# Altium schematic sheet Preregulation.SchDoc
size A3
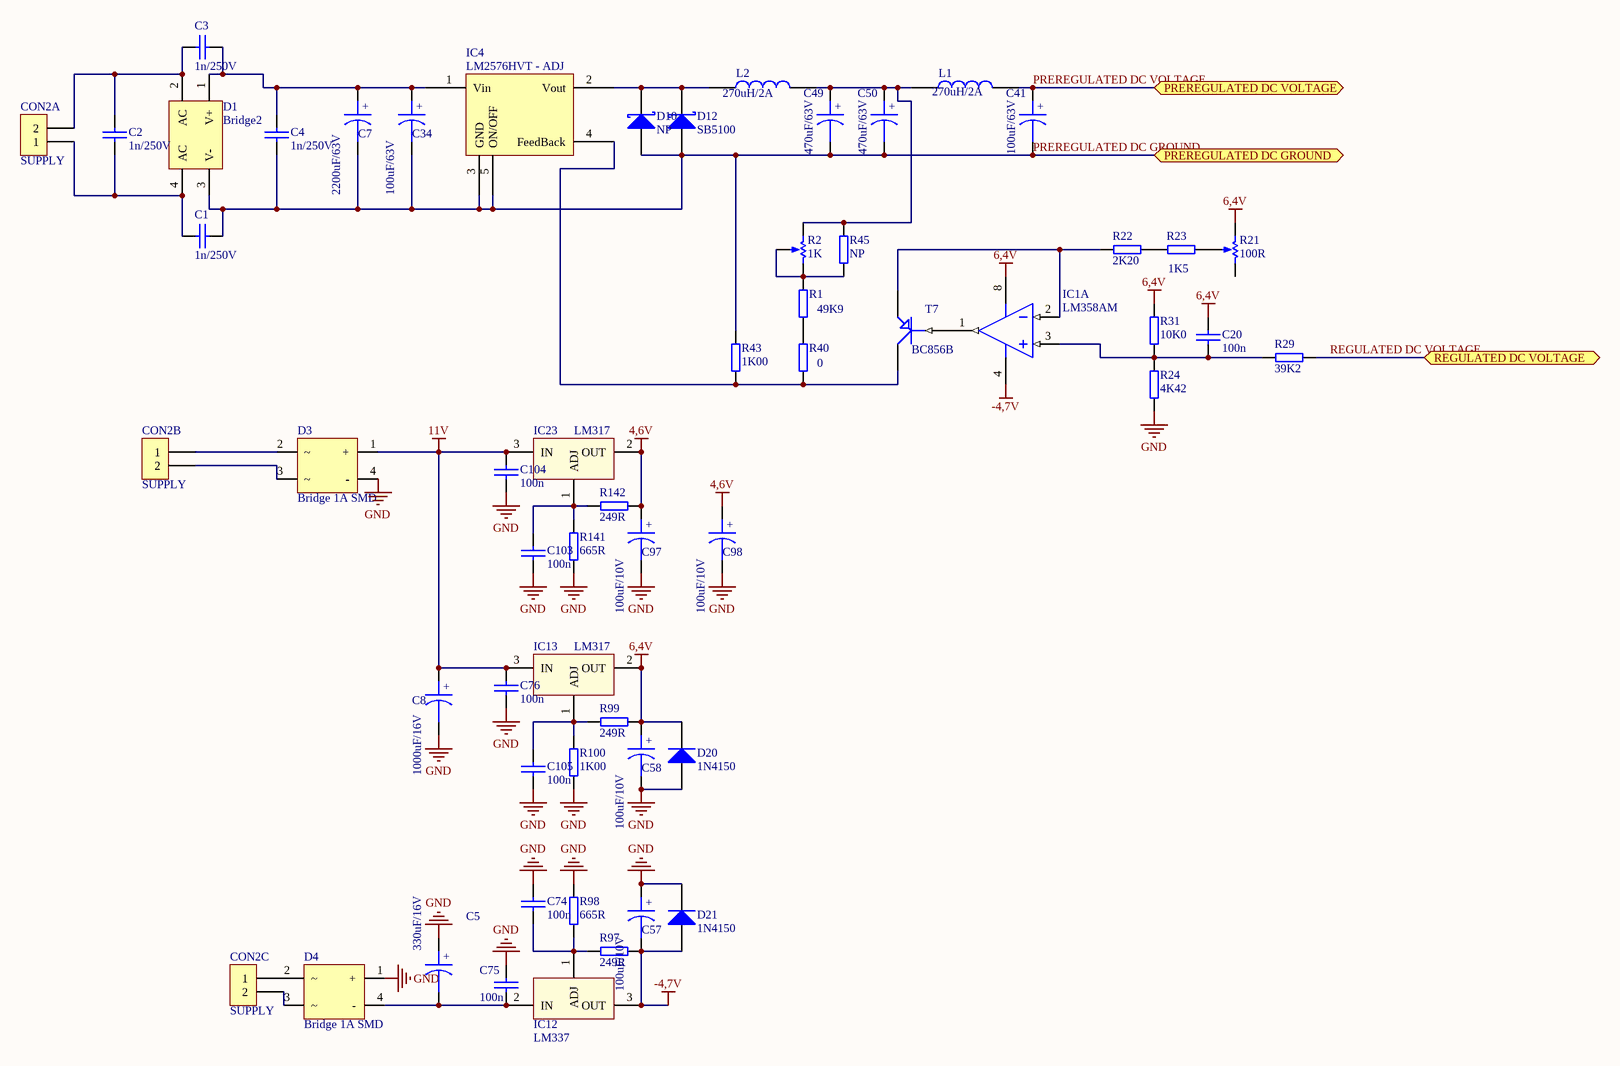
[diagram p0: Preregulation.SchDoc]

## Parts
C1  1n/250V  [CAPC3225X220N]
C2  1n/250V  [CAPC3225X220N]
C3  1n/250V  [CAPC3225X220N]
C4  1n/250V  [CAPC3225X220N]
C5  330uF/16V  [CAP40x20]
C7  2200uF/63V  [CP4/8.5]
C8  1000uF/16V  [CAP40x20]
C20  100n  [SM-0805]
C34  100uF/63V  [CP2/5]
C41  100uF/63V  [CP2/5]
C49  470uF/63V  [CP3/7]
C50  470uF/63V  [CP3/7]
C57  100uF/10V  [CP1/2.5]
C58  100uF/10V  [CP1/2.5]
C74  100n  [SM-0805]
C75  100n  [SM-0805]
C76  100n  [SM-0805]
C97  100uF/10V  [CP1/2.5]
C98  100uF/10V  [CP1/2.5]
C103  100n  [SM-0805]
C104  100n  [SM-0805]
C105  100n  [SM-0805]
CON2A  SUPPLY  [JACK2_NAM]
CON2B  SUPPLY  [JACK2_NAM]
CON2C  SUPPLY  [JACK2_NAM]
D1  Bridge2  [DIODE BRIDGE(FLAT) BIG]
D3  Bridge 1A SMD  [SDIP]
D4  Bridge 1A SMD  [SDIP]
D10  NP  [TO-220AC]
D12  SB5100  [D5A]
D20  1N4150  [SOD80, LL-34]
D21  1N4150  [SOD80, LL-34]
IC1  LM358AM  [SO-8]  (part A of 2)
IC4  LM2576HVT - ADJ  [LM2576]
IC12  LM337  [QTO-220]
IC13  LM317  [MP04A_N]
IC23  LM317  [QTO-220N]
L1  270uH/2A  [CP2/5]
L2  270uH/2A  [Trans6c]
R1  49K9  [SM-0805]
R2  1K  [POT SMD 3mm]
R21  100R  [POT SMD 3mm]
R22  2K20  [SM-0805]
R23  1K5  [SM-0805]
R24  4K42  [SM-0805]
R29  39K2  [SM-0805]
R31  10K0  [SM-0805]
R40  0  [SM-0805]
R43  1K00  [SM-0805]
R45  NP  [SM-0805]
R97  249R  [SM-0805]
R98  665R  [SM-0805]
R99  249R  [SM-0805]
R100  1K00  [SM-0805]
R141  665R  [SM-0805]
R142  249R  [SM-0805]
T7  BC856B  [SOT23-3]

## Ports
PREREGULATED DC GROUND, PREREGULATED DC VOLTAGE, REGULATED DC VOLTAGE

## Nets
4,6V: C97.1 C98.1 IC23.2(OUT) R142.1
6,4V: C20.2 C58.1 D20.2(K) IC1.8(V+) IC13.2(OUT) R21.3(BOT) R31.2 R99.1
11V: C8.1 C76.2 C104.2 D3.1(+) IC13.3(IN) IC23.3(IN)
-4,7V: C57.2 D21.1(A) IC1.4(GND) IC12.3(OUT) R97.1
GND: C5.1 C8.2 C57.1 C58.2 C74.2 C75.2 C76.1 C97.2 C98.2 C103.1 C104.1 C105.1 D3.4(-) D4.1(+) D20.1(A) D21.2(K) R24.1 R98.2 R100.1 R141.1
PREREGULATED DC GROUND: C1.2 C4.1 C7.2 C34.2 C41.2 C49.2 C50.2 D1.3(V-) D10.1(A) D12.1(A) IC4.3(GND) IC4.5(ON/OFF) R43.1 ; port PREREGULATED DC GROUND
PREREGULATED DC VOLTAGE: C41.1 L1.2 ; port PREREGULATED DC VOLTAGE
REGULATED DC VOLTAGE: R29.1 ; port REGULATED DC VOLTAGE
NetC1_1: C1.1 C2.1 CON2A.1 D1.4(AC)
NetC2_2: C2.2 C3.1 CON2A.2 D1.2(AC)
NetC3_2: C3.2 C4.2 C7.1 C34.1 D1.1(V+) IC4.1(Vin)
NetC5_2: C5.2 C75.1 D4.4(-) IC12.2(IN)
NetC20_1: C20.1 IC1.3(INA+) R24.2 R29.2 R31.1
NetC49_1: C49.1 C50.1 L1.1 L2.2 R2.3(BOT) R45.1
NetC74_1: C74.1 IC12.1(ADJ) R97.2 R98.1
NetC103_2: C103.2 IC23.1(ADJ) R141.2 R142.2
NetC105_2: C105.2 IC13.1(ADJ) R99.2 R100.2
NetCON2B_1: CON2B.1 D3.2
NetCON2B_2: CON2B.2 D3.3
NetCON2C_1: CON2C.1 D4.2
NetCON2C_2: CON2C.2 D4.3
NetD10_2: D10.2(K) D12.2(K) IC4.2(Vout) L2.1
NetIC1_1: IC1.1(OUTA) T7.1(B)
NetIC1_2: IC1.2(INA-) R22.1 T7.2(E)
NetIC4_4: IC4.4(FeedBack) R40.2 R43.2 T7.3(C)
NetR1_1: R1.1 R2.1(TOP) R2.2(TAP) R45.2
NetR1_2: R1.2 R40.1
NetR21_2: R21.2(TAP) R23.2
NetR22_2: R22.2 R23.1

Not connected (* = marked no-connect by the designer): R21 1(TOP)

## Notes on the sheet
- (in symbol CAPACITOR POL) +

## Library data of the parts
C1-C4 C20 C74-C76 C103-C105 = CAP: Capacitor
C5 C7 C8 C34 C41 C49 C50 C57 C58 C97 C98 = CAPACITOR POL: Capacitor
CON2A CON2B CON2C = CON2: Connector
D1 = Bridge2: Diode Bridge; pin to pad: 2>3 3>4 4>2; Published: 24-Mar-1999; LatestRevisionDate: 17-Jul-2002; LatestRevisionNote: Re-released for DXP Platform.; PackageReference: D-46_6A; Publisher: Altium Limited; PackageDescription: Bridge Rectifier; 4 Terminals; Body 16.8 x 16.8 mm (typ); Pitch 10.67 mm
D3 D4 = Diode Bridge Flate: Diode Bridge
D10 = D Schottky: Schottky Diode; pin to pad: 1>3 2>1; Published: 8-Jun-2000; LatestRevisionDate: 17-Jul-2002; LatestRevisionNote: Re-released for DXP Platform.; PackageReference: SMB; Publisher: Altium Limited; PackageDescription: DO-214-AA/SMB; 2 C-Bend Leads; Body 5.3 x 3.6 mm, inc. leads (LxW); Code_JEDEC: DO-214-AA
D12 = D Schottky: Schottky Diode; Published: 8-Jun-2000; LatestRevisionDate: 17-Jul-2002; LatestRevisionNote: Re-released for DXP Platform.; PackageReference: SMB; Publisher: Altium Limited; PackageDescription: DO-214-AA/SMB; 2 C-Bend Leads; Body 5.3 x 3.6 mm, inc. leads (LxW); Code_JEDEC: DO-214-AA
D20 D21 = Diode 1N4007: 1 Amp General Purpose Rectifier; pin to pad: 1>A 2>K; Published: 8-Jun-2000; LatestRevisionDate: 17-Jul-2002; LatestRevisionNote: Re-released for DXP Platform.; DatasheetDocument: 1998; PackageDocument: Aug-1999; PackageReference: DO-41; Publisher: Altium Limited; Code_JEDEC: DO-204-AL; ComponentLink1Description: Manufacturer Link; ComponentLink1URL: http://www.fairchildsemi.com/; ComponentLink2Description: Datasheet; ComponentLink2URL: http://www.fairchildsemi.com/ds/1N%2F1N4001.pdf
IC1 = LM358AM: Low Power Dual Operational Amplifier, 8-pin Narrow SOIC; Manufacturer: National Semiconductor; PackageTopMarking: NSZXTT*LM*358AM; PowerWise: N; CompType: Amplifiers; Published: 4-Dec-2008; LatestRevisionDate: 13-Jan-2009; LatestRevisionNote: Sim Model Added.; DatasheetVersion: Oct-2005; PackageVersion: revM, May-2009; PackageReference: M08A; Publisher: Altium Limited; PackageDescription: SOIC Narrow, 4.9 x 3.9 x 1.45mm, 8 Lead, 1.27mm Pitch; Supplier 1: Farnell; Supplier Part Number 1: 9486801; PartNumber: LM358AM; RoHS: N; PinCount: 8; Code_JEDEC: MS-012-AA; Code_IPC: SOIC127P600-8; ComponentLink1Description: LM358 Datasheet; ComponentLink1URL: http://www.national.com/ds/LM/LM358.pdf; ComponentLink2Description: LM358 Web Page; ComponentLink2URL: http://www.national.com/pf/LM/LM358.html; ComponentLink3Description: M08A Package Page; ComponentLink3URL: http://www.national.com/packaging/folders/m08a.html
IC4 = LM2576: LM2576 - ADJ
IC12 = LM337: On ap (-)     -1.2 -> - 37V; Value: LM337
IC13 IC23 = LM317: Adj Voltage +1.2 -> +37V; Value: LM317
L1 = INDUCTOR
L2 = INDUCTOR: pin to pad: 1>5 2>6
R1 R22-R24 R29 R31 R40 R43 R97-R100 R141 R142 = RES2: tme.vn
R2 R21 = RPot: Potentiometer; Published: *; LatestRevisionDate: *; LatestRevisionNote: *; PackageReference: *; Publisher: *; Sim Note: *; Set Position: *; Value: *
R45 = RES2
T7 = PNP1: Công ty C? ph?n TQCOM